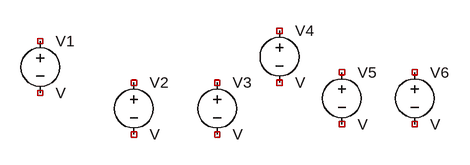
[diagram p0: schematic Draft10.asc]
Draft10.asc, the LTspice schematic file:
Version 4.1
SHEET 1 880 680
SYMBOL voltage -96 80 R0
SYMATTR InstName V1
SYMBOL voltage 48 144 R0
SYMATTR InstName V2
SYMBOL voltage 176 144 R0
SYMATTR InstName V3
SYMBOL voltage 272 64 R0
SYMATTR InstName V4
SYMBOL voltage 368 128 R0
SYMATTR InstName V5
SYMBOL voltage 480 128 R0
SYMATTR InstName V6

The netlist it stands for:
* Draft10.asc
V1 NC_01 NC_02 V
V2 NC_03 NC_04 V
V3 NC_05 NC_06 V
V4 NC_07 NC_08 V
V5 NC_09 NC_10 V
V6 NC_11 NC_12 V
.backanno
.end